# Altium schematic sheet Power.SchDoc: =ProjectTitle
size B; Engineer: H. Collector; Organization: IMR Engineering; Address1: 3621 Gin Way; Address2: Snellville, GA 30039; Address3: USA; SheetNumber: 10; SheetTotal: 10
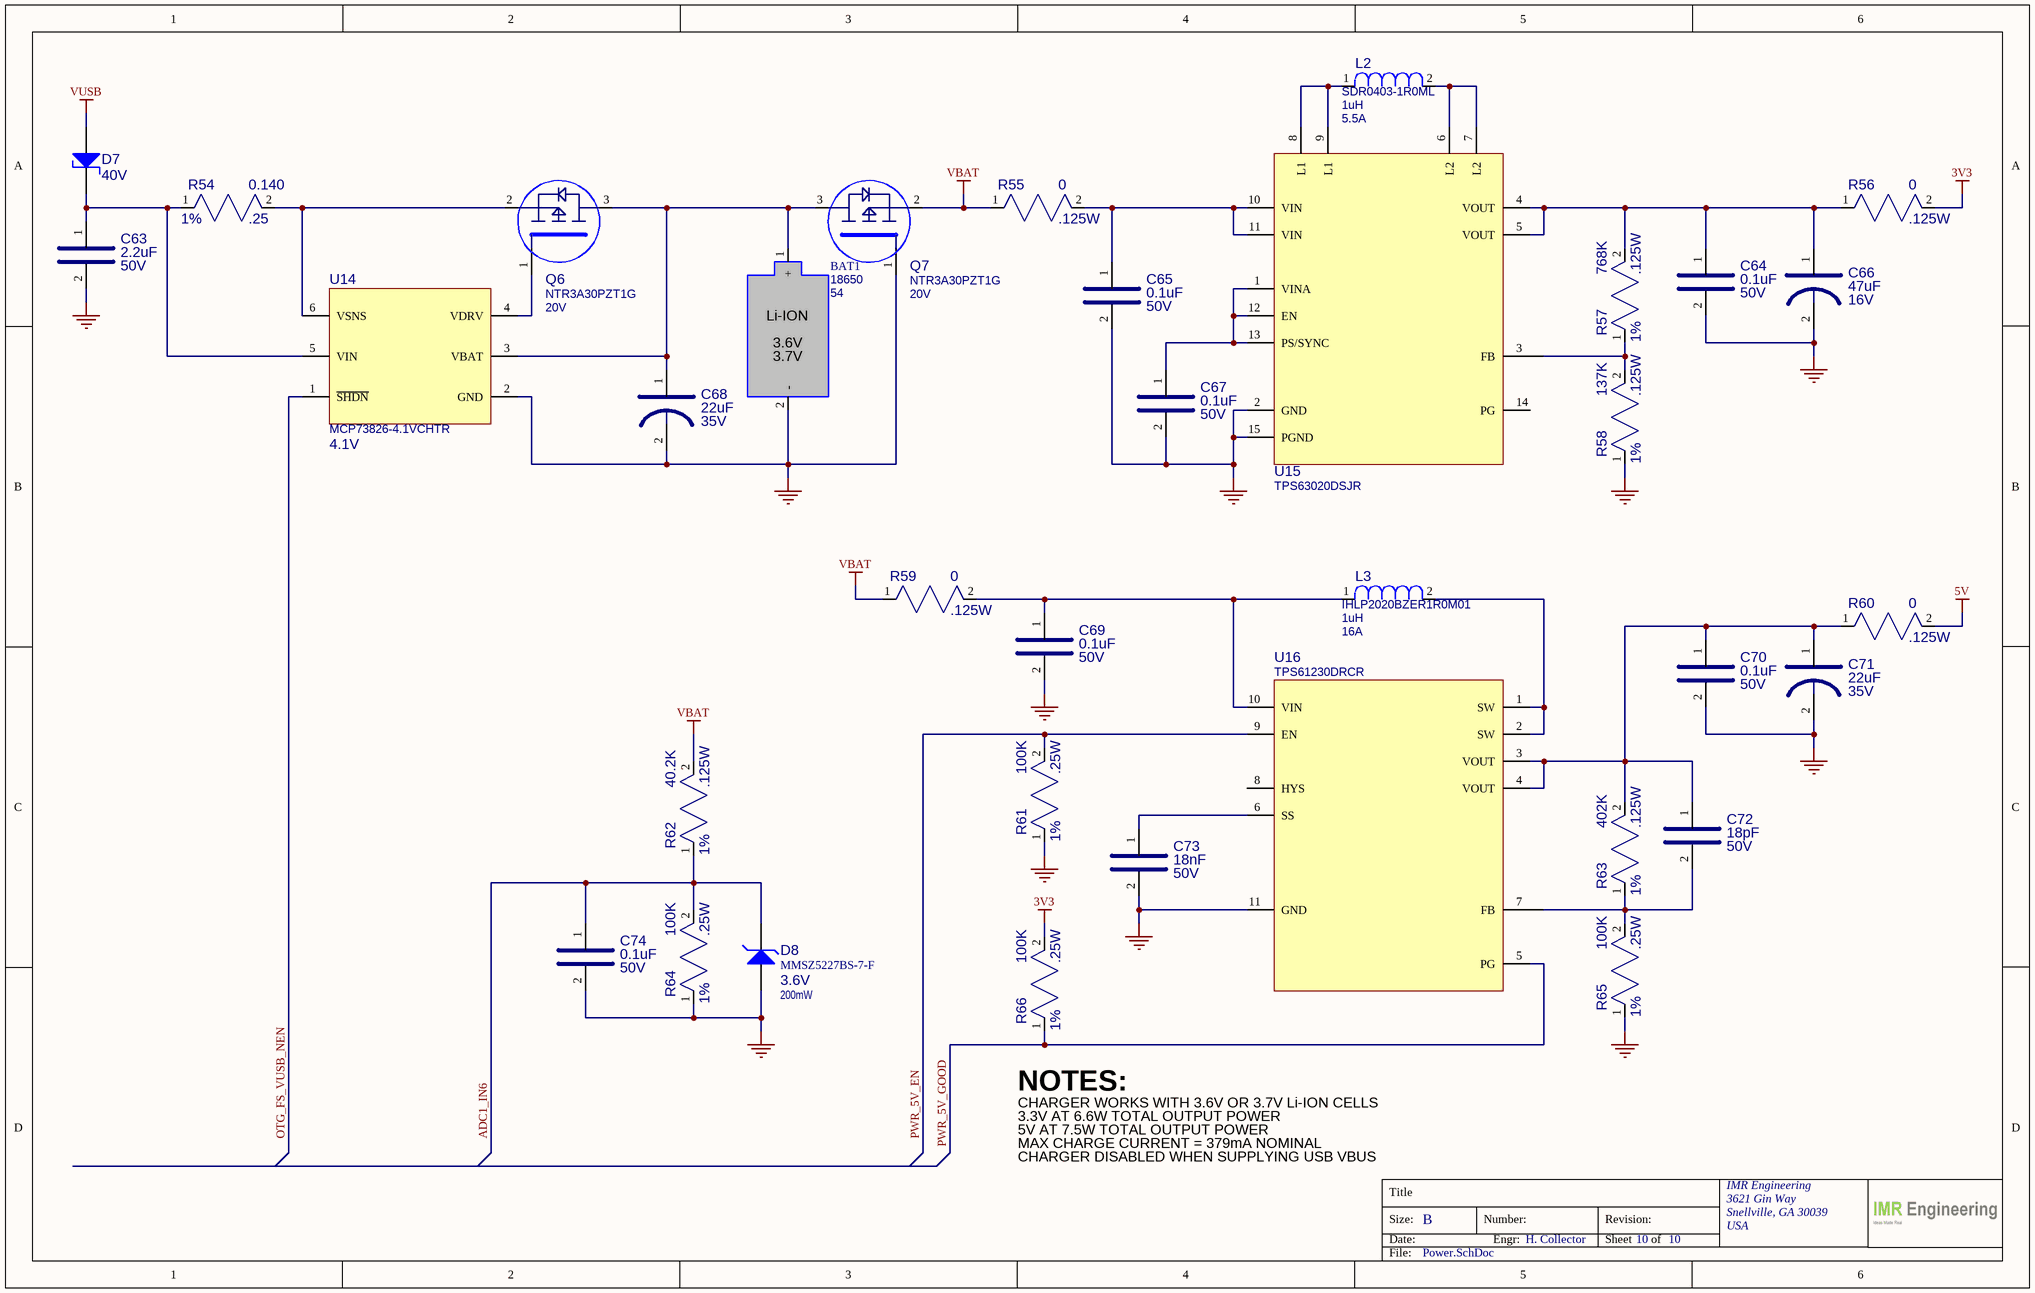
[diagram p0: Power.SchDoc]

## Parts
BAT1  value 18650  [CONN_BATTERY_18650]  (hidden comment: 54)
C63  value 2.2uF  VOLTAGE: 50V  [CAP_0805]  (hidden comment: UMK212BB7225MG-T)
C64  value 0.1uF  VOLTAGE: 50V  [CAP_0805]  (hidden comment: 08055C104KAT2A)
C65  value 0.1uF  VOLTAGE: 50V  [CAP_0805]  (hidden comment: 08055C104KAT2A)
C66  value 47uF  VOLTAGE: 16V  [CAP_ALE_SMD_6.6x6.6]  (hidden comment: UCL1C470MCL6GS)
C67  value 0.1uF  VOLTAGE: 50V  [CAP_0805]  (hidden comment: 08055C104KAT2A)
C68  value 22uF  VOLTAGE: 35V  [CAP_ALE_SMD_6.6x6.6]  (hidden comment: UZS1C220MCL1GB)
C69  value 0.1uF  VOLTAGE: 50V  [CAP_0805]  (hidden comment: 08055C104KAT2A)
C70  value 0.1uF  VOLTAGE: 50V  [CAP_0805]  (hidden comment: 08055C104KAT2A)
C71  value 22uF  VOLTAGE: 35V  [CAP_ALE_SMD_6.6x6.6]  (hidden comment: UZS1C220MCL1GB)
C72  value 18pF  VOLTAGE: 50V  [CAP_0805]  (hidden comment: CML0805C0G180JT50V)
C73  value 18nF  VOLTAGE: 50V  [CAP_0805]  (hidden comment: CC0805KRX7R9BB183)
C74  value 0.1uF  VOLTAGE: 50V  [CAP_0805]  (hidden comment: 08055C104KAT2A)
D7  value 40V  [SMB]  (hidden comment: MBRS2040LT3G)
D8  value 3.6V  POWER: 200mW  [SOD323]  (hidden comment: MMSZ5227BS-7-F)
L2  value 1uH  Current: 5.5A  [IND_SDR0403]  (hidden comment: SDR0403-1R0ML)
L3  value 1uH  Current: 16A  [INDPM5552X200N]  (hidden comment: IHLP2020BZER1R0M01)
Q6  value 20V  [SOT-23]  (hidden comment: NTR3A30PZT1G)
Q7  value 20V  [SOT-23]  (hidden comment: NTR3A30PZT1G)
R54  value 0.140  TOLERANCE: 1%  POWER: .25  [1206]  (hidden comment: RL1206FR-070R14L)
R55  value 0  POWER: .125W  [PMG_RES_0805]  (hidden comment: RC0805JR-070RL)
R56  value 0  POWER: .125W  [PMG_RES_0805]  (hidden comment: RC0805JR-070RL)
R57  value 768K  TOLERANCE: 1%  POWER: .125W  [PMG_RES_0805]  (hidden comment: RC0805FR-07768KL)
R58  value 137K  TOLERANCE: 1%  POWER: .125W  [PMG_RES_0805]  (hidden comment: RC0805FR-07137KL)
R59  value 0  POWER: .125W  [PMG_RES_0805]  (hidden comment: RC0805JR-070RL)
R60  value 0  POWER: .125W  [PMG_RES_0805]  (hidden comment: RC0805JR-070RL)
R61  value 100K  TOLERANCE: 1%  POWER: .25W  [PMG_RES_0805]  (hidden comment: RK73H2ATTD1003F)
R62  value 40.2K  TOLERANCE: 1%  POWER: .125W  [RES_0805]  (hidden comment: RC0805FR-0740K2L)
R63  value 402K  TOLERANCE: 1%  POWER: .125W  [RES_0805]  (hidden comment: RC0805FR-07402KL)
R64  value 100K  TOLERANCE: 1%  POWER: .25W  [PMG_RES_0805]  (hidden comment: RK73H2ATTD1003F)
R65  value 100K  TOLERANCE: 1%  POWER: .25W  [PMG_RES_0805]  (hidden comment: RK73H2ATTD1003F)
R66  value 100K  TOLERANCE: 1%  POWER: .25W  [PMG_RES_0805]  (hidden comment: RK73H2ATTD1003F)
U14  value 4.1V  [SOT23-6]  (hidden comment: MCP73826-4.1VCHTR)
U15  TPS63020DSJR  [14VSON]
U16  TPS61230DRCR  [10VSON]

## Nets
3V3: R56.2 R66.2
5V: R60.2
GND: BAT1.2(-) C63.2 C64.2 C65.2 C66.2 C67.2 C68.2 C69.2 C70.2 C71.2 C73.2 C74.2 D8.1(A) Q7.1(B) R58.1 R61.1 R64.1 R65.1 U14.2(GND) U15.2(GND) U15.15(PGND) U16.11(GND)
VBAT: Q7.2(E) R55.1 R59.1 R62.2
VUSB: D7.1(A)
ADC1_IN6: C74.1 D8.2(K) R62.1 R64.2
OTG_FS_VUSB_NEN: U14.1(~{SHDN})
PWR_5V_EN: R61.2 U16.9(EN)
PWR_5V_GOOD: R66.1 U16.5(PG)
NetBAT1_1: BAT1.1(+) C68.1 Q6.3(C) Q7.3(C) U14.3(VBAT)
NetC63_1: C63.1 D7.2(K) R54.1 U14.5(VIN)
NetC64_1: C64.1 C66.1 R56.1 R57.2 U15.4(VOUT) U15.5(VOUT)
NetC65_1: C65.1 R55.2 U15.10(VIN) U15.11(VIN)
NetC67_1: C67.1 U15.1(VINA) U15.12(EN) U15.13(PS/SYNC)
NetC69_1: C69.1 L3.1 R59.2 U16.10(VIN)
NetC70_1: C70.1 C71.1 C72.1 R60.1 R63.2 U16.3(VOUT) U16.4(VOUT)
NetC72_2: C72.2 R63.1 R65.2 U16.7(FB)
NetC73_1: C73.1 U16.6(SS)
NetL2_1: L2.1 U15.8(L1) U15.9(L1)
NetL2_2: L2.2 U15.6(L2) U15.7(L2)
NetL3_2: L3.2 U16.1(SW) U16.2(SW)
NetQ6_1: Q6.1(B) U14.4(VDRV)
NetQ6_2: Q6.2(E) R54.2 U14.6(VSNS)
NetR57_1: R57.1 R58.2 U15.3(FB)

Not connected (* = marked no-connect by the designer): U15 14(PG); U16 8(HYS)

## Notes on the sheet
- (near R66) NOTES:
- CHARGER WORKS WITH 3.6V OR 3.7V Li-ION CELLS
- 3.3V AT 6.6W TOTAL OUTPUT POWER
- 5V AT 7.5W TOTAL OUTPUT POWER
- MAX CHARGE CURRENT = 379mA NOMINAL
- CHARGER DISABLED WHEN SUPPLYING USB VBUS
- Title
- Size:
- Date:
- B
- Number:
- Engr:
- Revision:
- Sheet
- of
- File:
- (in symbol CONN_BATTERY_18650) Li-ION; 3.6V; 3.7V

## Library data of the parts
BAT1 = CONN_BATTERY_18650: BATTERY CONTACT CLP 18650 PC PIN (NOTE: QTY x2); MFG: Keystone Electronics; Case/Package: 2P_2.54MM; Supplier 1: Digi-Key; Supplier Part Number 1: 36-54-ND; MFG_PN: 54
C63 = CAP_2.2UF_50V_0805: CAP CER 2.2UF 50V X7R 0805; MFG: Taiyo Yuden; TOLERANCE: 20%; MFG_PN: UMK212BB7225MG-T; Supplier 1: Digi-Key; Supplier Part Number 1: 587-4963-1-ND; Case/Package: 0805; ClassName: Power_Charger
C64 C65 C67 C69 C70 C74 = CAP_0.1UF_50V_0805: CAP CER 0.1UF 50V X7R 0805; MFG: AVX; TOLERANCE: 10%; MFG_PN: 08055C104KAT2A; Supplier 1: Digi-Key; Supplier Part Number 1: 478-1395-1-ND; Case/Package: 0805
  C64 C67: ClassName: Power_3V3; Parameter 1: *
  C65: ClassName: Power_3V3
  C69 C70: ClassName: Power_5V
  C74: ClassName: Power_VBAT_Monitor
C66 = CAP_47UF_16V_ALE_NF: CAP ALUM 47UF 20% 16V SMD; MFG: NICHICON; MFG_PN: UCL1C470MCL6GS; TOLERANCE: 20%; Supplier 1: Digi-Key; Supplier Part Number 1: 493-3916-1-ND
C68 C71 = CAP_22UF_35V_ALE_NF: CAP, AL E, 22UF, 35V, 20%, ROHS; MFG: NICHICON; MFG_PN: UZS1C220MCL1GB; TOLERANCE: 20%; Supplier 1: Digi-Key; Supplier Part Number 1: 493-10138-1-ND
  C71: ClassName: Power_5V
C72 = CAP_18PF_50V_0805: CAP CER 18PF 50V C0G/NP0 0805; MFG: Stackpole Electronics Inc; TOLERANCE: 5%; MFG_PN: CML0805C0G180JT50V; Supplier 1: Digi-Key; Supplier Part Number 1: 738-CML0805C0G180JT50VCT-ND; Case/Package: 0805; ClassName: Power_5V
C73 = CAP_18NF_50V_0805: CAP CER 0.018UF 50V X7R 0805; MFG: Yageo; TOLERANCE: 10%; MFG_PN: CC0805KRX7R9BB183; Supplier 1: Digi-Key; Supplier Part Number 1: 311-1137-1-ND; Case/Package: 0805; ClassName: Power_5V
D7 = DIODE_SCHOTTKY_MBRS2040LT3G: DIODE SCHOTTKY 40V 2A SMB; MFG: ON SEMICONDUCTOR; PackageReference: DO-35; ComponentLink1Description: Manufacturer Link; ComponentLink1URL: http://www.fairchildsemi.com/; ComponentLink2Description: Datasheet; ComponentLink2URL: http://www.fairchildsemi.com/ds/1N%2F1N4148.pdf; Supplier 1: Digi-Key; Supplier Part Number 1: MBRS2040LT3GOSCT-ND; MFG_PN: MBRS2040LT3G; Current: 2A; Case/Package: SMB; ClassName: Power_Charger
D8 = DIODE_ZENER_MMSZ5227BS-7-F: DIODE ZENER 3.6V 200MW SOD323; MFG: Vishay Semiconductor; Case/Package: SOD323; Supplier 1: Digi-Key; Supplier Part Number 1: MMSZ5227BS-FDICT-ND; MFG_PN: MMSZ5227BS-7-F; ClassName: Power_VBAT_Monitor
L2 = INDUCTOR_SDR0403-1R0ML: FIXED IND 1UH 3.8A 33 MOHM SMD; MFG: Bourns Inc.; TOLERANCE: 20%; Supplier 1: Digi-Key; Supplier Part Number 1: SDR0403-1R0MLCT-ND; MFG_PN: SDR0403-1R0ML; ClassName: Power_3V3; Parameter 1: *
L3 = INDUCTOR_IHLP2020BZER1R0M01: FIXED IND 1UH 3.8A 33 MOHM SMD; MFG: Bourns Inc.; TOLERANCE: 20%; Supplier 1: Digi-Key; Supplier Part Number 1: 541-1087-1-ND; MFG_PN: IHLP2020BZER1R0M01; ClassName: Power_5V
Q6 Q7 = MOSFET_PCH_NTR3A30PZT1G: MOSFET P-CH 20V 3A SOT23-3; MFG: ON Semiconductor; ComponentLink1Description: Manufacturer Link; ComponentLink1URL: http://www.fairchildsemi.com/; ComponentLink2Description: Datasheet; ComponentLink2URL: http://www.fairchildsemi.com/ds/2N%2F2N3904.pdf; Supplier 1: Digi-Key; Supplier Part Number 1: NTR3A30PZT1GOSCT-ND; MFG_PN: NTR3A30PZT1G
  Q6: ClassName: Power_Charger
  Q7: ClassName: Power_VBAT_Monitor
R54 = RES_0.140_1206_1/4W_1%: RES 0.14 OHM 1% 1/4W 1206; MFG: Yageo; Case/Package: 1206; MFG_PN: RL1206FR-070R14L; Supplier 1: Digi-Key; Supplier Part Number 1: 311-.14LWCT-ND; ClassName: Power_Charger
R55 R56 R59 R60 = RES_0_0805_1/8W: RES SMD 0 OHM JUMPER 1/8W 0805; MFG: Yageo; Case/Package: 0805; MFG_PN: RC0805JR-070RL; Supplier 1: Digi-Key; Supplier Part Number 1: 311-0.0ARCT-ND; TOLERANCE: JUMPER
  R55 R56: ClassName: Power_3V3; Parameter 1: *
  R59 R60: ClassName: Power_5V
R57 = RES_768K_0805_1/8W_1%: RES SMD 768K OHM 1% 1/8W 0805; MFG: Yageo; Case/Package: 0805; MFG_PN: RC0805FR-07768KL; Supplier 1: Digi-Key; Supplier Part Number 1: 311-768KCRCT-ND; ClassName: Power_3V3; Parameter 1: *
R58 = RES_137K_0805_1/8W_1%: RES SMD 137K OHM 1% 1/8W 0805; MFG: Yageo; Case/Package: 0805; MFG_PN: RC0805FR-07137KL; Supplier 1: Digi-Key; Supplier Part Number 1: 311-137KCRCT-ND; ClassName: Power_3V3; Parameter 1: *
R61 R64-R66 = RES_100K_0805_1/4W_1%: RES SMD 100K OHM 1% 1/4W 0805; MFG: KOA Speer Electronics, Inc.; Case/Package: 0805; MFG_PN: RK73H2ATTD1003F; Supplier 1: Digi-Key; Supplier Part Number 1: 2019-RK73H2ATTD1003FCT-ND
  R61 R65 R66: ClassName: Power_5V
  R64: ClassName: Power_VBAT_Monitor
R62 = RES_40.2K_0805_1/8W_1%_1: RES SMD 40.2K OHM 1% 1/8W 0805; MFG: Yageo; Case/Package: 0805; MFG_PN: RC0805FR-0740K2L; Supplier 1: Digi-Key; Supplier Part Number 1: 311-40.2KCRCT-ND; ClassName: Power_VBAT_Monitor
R63 = RES_402K_0805_1/8W_1%: RES SMD 402K OHM 1% 1/8W 0805; MFG: Yageo; Case/Package: 0805; MFG_PN: RC0805FR-07402KL; Supplier 1: Digi-Key; Supplier Part Number 1: 311-402KCRCT-ND; ClassName: Power_5V
U14 = IC_MCP73826-4.1VCHTR: IC CONTROLLR LI-ION 4.1V SOT23-6; MFG: Microchip Technology; Supplier 1: Digi-Key; Supplier Part Number 1: MCP73826-4.1VCHCT-ND; MFG_PN: MCP73826-4.1VCHTR; ClassName: Power_Charger
U15 = IC_TPS63020DSJR: IC REG BCK BST ADJ 3.5A 14VSON; MFG: Texas Instruments; Case/Package: 14VSON; Supplier 1: Digi-Key; VALUE: 3.5A; Supplier Part Number 1: 296-36491-1-ND; MFG_PN: TPS63020DSJR; ClassName: Power_3V3; Parameter 1: *
U16 = IC_TPS61230DRCR: IC REG BOOST ADJ 4A 10VSON; MFG: Texas Instruments; Case/Package: 10VSON; Supplier 1: Digi-Key; VALUE: 4A; Supplier Part Number 1: 296-37761-1-ND; MFG_PN: TPS61230DRCR; ClassName: Power_5V